# EAGLE design MotorShieldV0.99.3-3 (EAGLE 9.5.0)
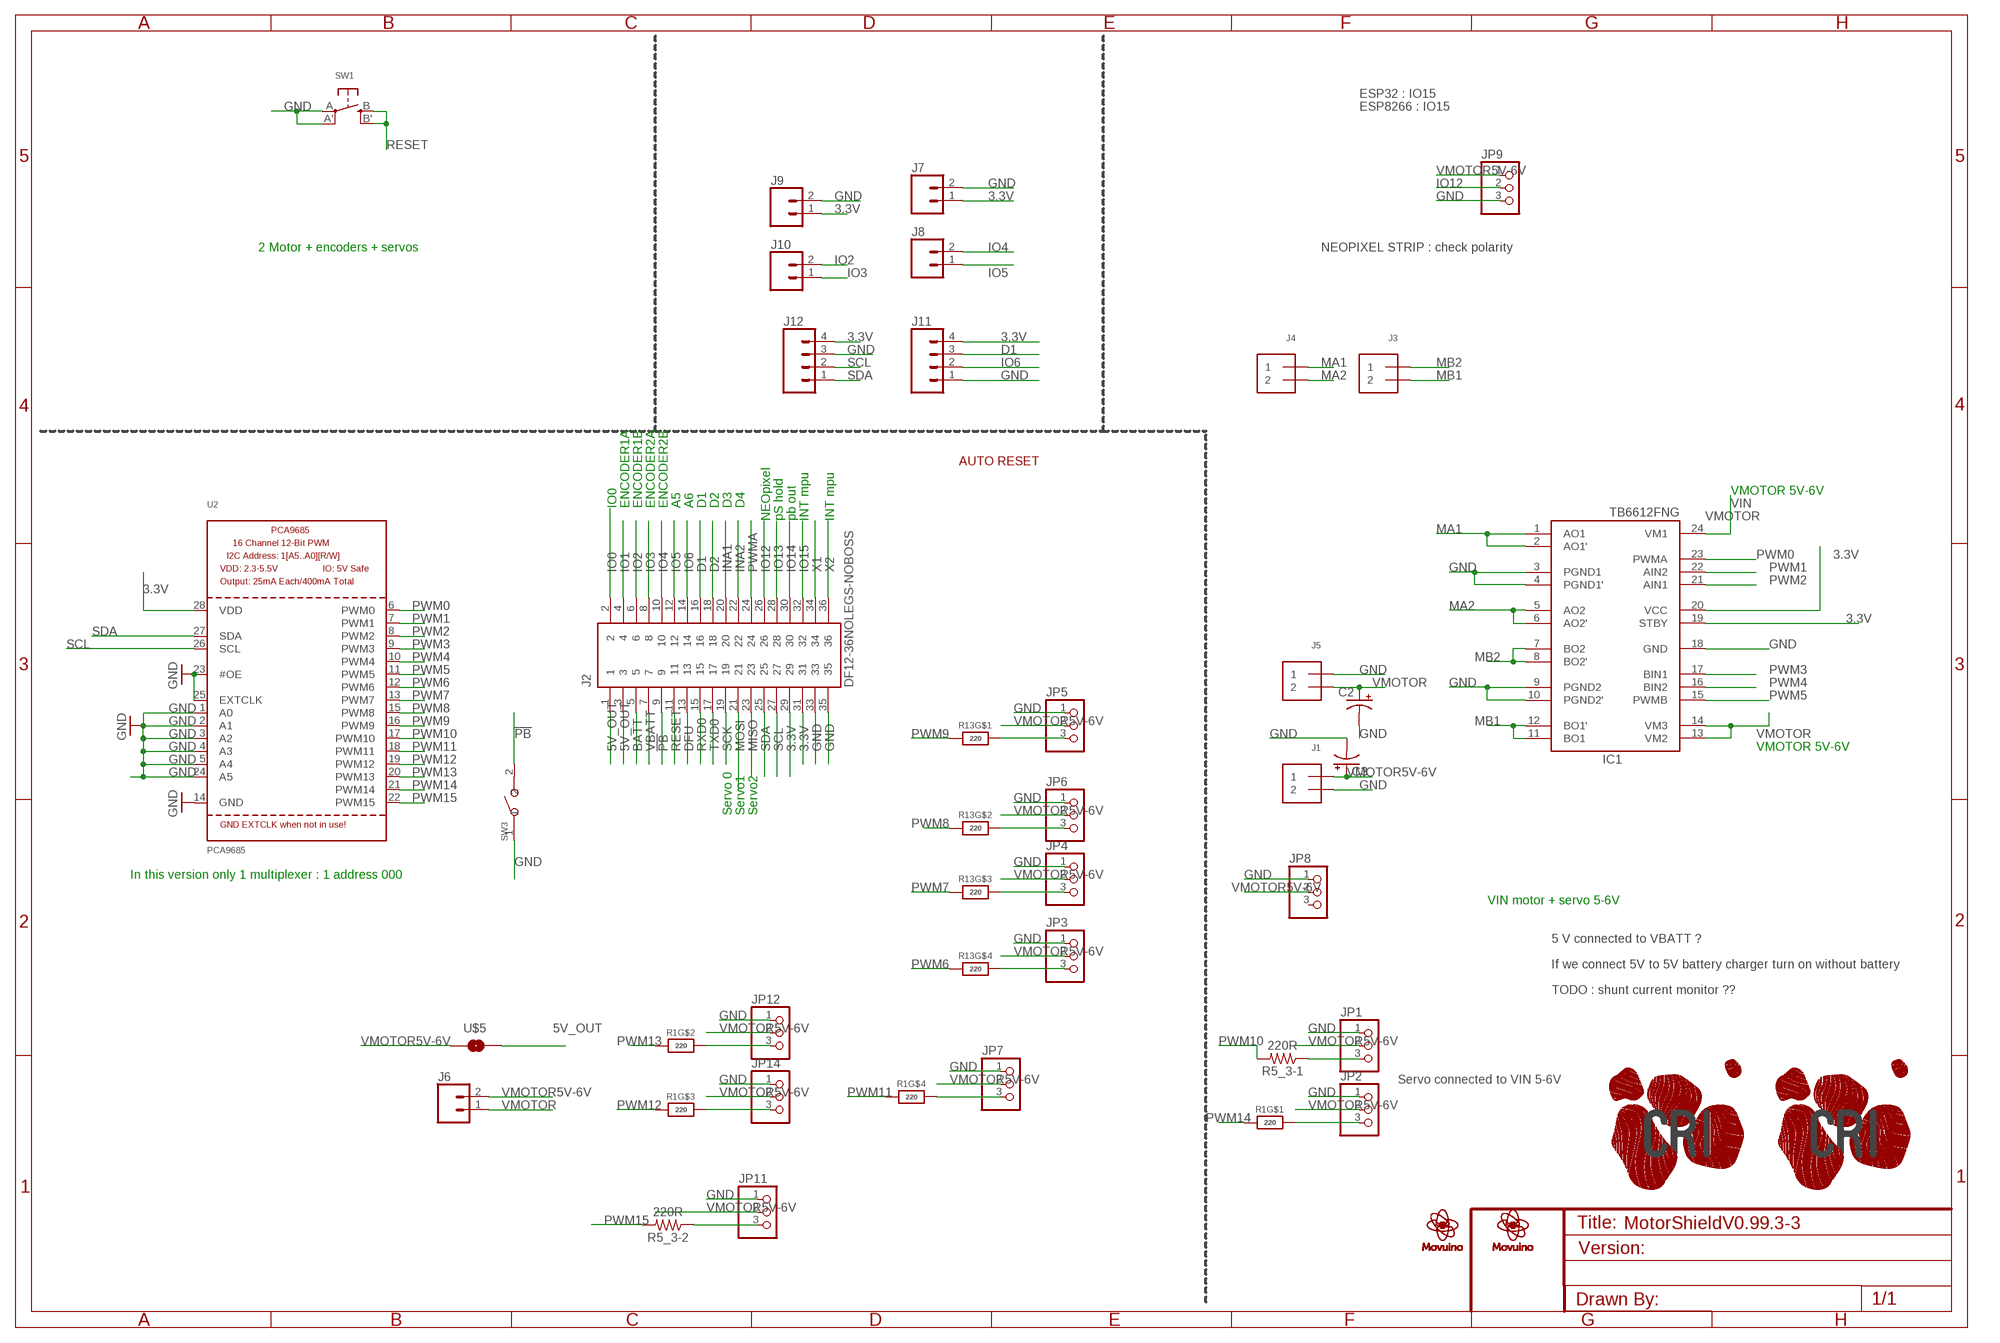
[diagram p0: schematic, sheet 1]

## Parts
C2  CPOL-USE3.5-8  [E3,5-8]
C3  CPOL-USE3.5-8  [E3,5-8]
IC1  TB6612FNG  [SSOP24]
J1  TERMBLOCK_1X2  [TERMBLOCK_1X2-3.5MM]
J2  DF12-36NOLEGS-NOBOSS  [DF12-36-DP-NL-NB]
J3  TERMBLOCK_1X2  [TERMBLOCK_1X2-3.5MM]
J4  TERMBLOCK_1X2  [TERMBLOCK_1X2-3.5MM]
J5  TERMBLOCK_1X2  [TERMBLOCK_1X2-3.5MM]
J6  CONN_02  [1X02]
J7  CONN_02  [1X02]
J8  CONN_02  [1X02]
J9  CONN_02  [1X02]
J10  CONN_02  [1X02]
J11  CONN_04  [1X04]
J12  CONN_04  [1X04]
JP1  PINHD-1X3  [1X03]
JP2  PINHD-1X3  [1X03]
JP3  PINHD-1X3  [1X03]
JP4  PINHD-1X3  [1X03]
JP5  PINHD-1X3  [1X03]
JP6  PINHD-1X3  [1X03]
JP7  PINHD-1X3  [1X03]
JP8  PINHD-1X3  [1X03]
JP9  PINHD-1X3  [1X03]
JP11  PINHD-1X3  [1X03]
JP12  PINHD-1X3  [1X03]
JP14  PINHD-1X3  [1X03]
R1  220  RESISTOR_4PACK  [RESPACK_4X0603]
R5_3-1  220R  RESISTORR0402-SMALL-TDOCU  [R0402-SMALL-TDOCU]
R5_3-2  220R  RESISTORR0402-SMALL-TDOCU  [R0402-SMALL-TDOCU]
R13  220  RESISTOR_4PACK  [RESPACK_4X0603]
SW1  SWITCH_TACT_SMT  [EVQ-Q2]
SW3  DIP-BUTTON(2P-6.0X3.0X4.3MM)-TS-1101F  [SW2-5.0-6.0X3.0X4.3MM]
U2  PCA9685  [TSSOP28]
U$1  LOGO_MOVUINOTOP  [LOGO_MOVUINO_BMP_10MM]
U$2  LOGO-CRI-NEW-110MM-BOTTOM-SILK  [LOGO_CRI-NEW-BMP10MM-BOTTOM]
U$3  LOGO-CRI-NEW-110MM-BOTTOM-SILK  [LOGO_CRI-NEW-BMP10MM-BOTTOM]
U$5  0402-JUMPERCLOSED-DEFAULT  [0402-JUMPER-CLOSED]
U$8  LOGO_MOVUINOBOTTOM_11MM  [LOGO_MOVUINO_BMP_11MM-BOTTOM]

## Nets
3.3V [pcbway_cheap]: IC1.19(STBY) IC1.20(VCC) J2.29 J2.31 J7.1 J9.1 J11.4 J12.4 U2.28(VDD)
5V_OUT [pcbway_cheap]: J2.1 J2.3 U$5.2
!PB! [pcbway_cheap]: J2.9 SW3.2
BATT [pcbway_cheap]: J2.5
D1 [pcbway_cheap]: J2.16 J11.3
D2 [pcbway_cheap]: J2.18
DFU [pcbway_cheap]: J2.13
GND [pcbway_cheap]: C2.- C3.- IC1.3(PGND1) IC1.4(PGND1') IC1.9(PGND2) IC1.10(PGND2') IC1.18(GND) J1.2 J2.33 J2.35 J5.1 J7.2 J9.2 J11.1 J12.3 JP1.1 JP2.1 JP3.1 JP4.1 JP5.1 JP6.1 JP7.1 JP8.1 JP9.3 JP11.1 JP12.1 JP14.1 SW1.A'(P1) SW1.A(P) SW3.1 U2.1(A0) U2.2(A1) U2.3(A2) U2.4(A3) U2.5(A4) U2.14(GND) U2.23(#OE) U2.24(A5) U2.25(EXTCLK)
INA1 [pcbway_cheap]: J2.20
INA2 [pcbway_cheap]: J2.22
IO0 [pcbway_cheap]: J2.2
IO1 [pcbway_cheap]: J2.4
IO2 [pcbway_cheap]: J2.6 J10.2
IO3 [pcbway_cheap]: J2.8 J10.1
IO4 [pcbway_cheap]: J2.10 J8.2
IO5 [pcbway_cheap]: J2.12 J8.1
IO6: J2.14 J11.2
IO12 [pcbway_cheap]: J2.26 JP9.2
IO13 [pcbway_cheap]: J2.28
IO14 [pcbway_cheap]: J2.30
IO15 [pcbway_cheap]: J2.32
MA1 [pcbway_cheap]: IC1.1(AO1) IC1.2(AO1') J4.1
MA2 [pcbway_cheap]: IC1.5(AO2) IC1.6(AO2') J4.2
MB1 [pcbway_cheap]: IC1.11(BO1) IC1.12(BO1') J3.2
MB2 [pcbway_cheap]: IC1.7(BO2) IC1.8(BO2') J3.1
MISO [pcbway_cheap]: J2.23
MOSI [pcbway_cheap]: J2.21
N$2: JP5.3 R13.8
N$3: JP6.3 R13.7
N$4: JP4.3 R13.6
N$6: JP3.3 R13.5
N$7: JP1.3 R5_3-1.1
N$8: JP2.3 R1.8
N$10: JP12.3 R1.7
N$11: JP14.3 R1.6
N$17: JP7.3 R1.5
N$18: JP11.3 R5_3-2.1
PWM0 [pcbway_cheap]: IC1.23(PWMA) U2.6(PWM0)
PWM1 [pcbway_cheap]: IC1.22(AIN2) U2.7(PWM1)
PWM2 [pcbway_cheap]: IC1.21(AIN1) U2.8(PWM2)
PWM3 [pcbway_cheap]: IC1.17(BIN1) U2.9(PWM3)
PWM4 [pcbway_cheap]: IC1.16(BIN2) U2.10(PWM4)
PWM5 [pcbway_cheap]: IC1.15(PWMB) U2.11(PWM5)
PWM6 [pcbway_cheap]: R13.4 U2.12(PWM6)
PWM7 [pcbway_cheap]: R13.3 U2.13(PWM7)
PWM8 [pcbway_cheap]: R13.2 U2.15(PWM8)
PWM9 [pcbway_cheap]: R13.1 U2.16(PWM9)
PWM10 [pcbway_cheap]: R5_3-1.2 U2.17(PWM10)
PWM11 [pcbway_cheap]: R1.4 U2.18(PWM11)
PWM12 [pcbway_cheap]: R1.3 U2.19(PWM12)
PWM13 [pcbway_cheap]: R1.2 U2.20(PWM13)
PWM14 [pcbway_cheap]: R1.1 U2.21(PWM14)
PWM15 [pcbway_cheap]: R5_3-2.2 U2.22(PWM15)
PWMA [pcbway_cheap]: J2.24
RESET [pcbway_cheap]: J2.11 SW1.B'(S1) SW1.B(S)
RXD0 [pcbway_cheap]: J2.15
SCK [pcbway_cheap]: J2.19
SCL [pcbway_cheap]: J2.27 J12.2 U2.26(SCL)
SDA [pcbway_cheap]: J2.25 J12.1 U2.27(SDA)
TXD0 [pcbway_cheap]: J2.17
VBATT [pcbway_cheap]: J2.7
VMOTOR: C2.+ IC1.13(VM2) IC1.14(VM3) IC1.24(VM1) J5.2 J6.1
VMOTOR5V-6V [pcbway_cheap]: C3.+ J1.1 J6.2 JP1.2 JP2.2 JP3.2 JP4.2 JP5.2 JP6.2 JP7.2 JP8.2 JP9.1 JP11.2 JP12.2 JP14.2 U$5.1
X1 [pcbway_cheap]: J2.34
X2 [pcbway_cheap]: J2.36
Unconnected: JP8.3

## Notes on the sheet
- ESP32 : IO15
- ESP8266 : IO15
- 2 Motor + encoders + servos | NEOPIXEL STRIP : check polarity
- AUTO RESET
- VMOTOR 5V-6V
- IO0 | ENCODER1A | ENCODER1B | ENCODER2A | ENCODER2B | A5 | A6 | D1 | D2 | D3 | D4 | VIN
- NEOpixel | pS hold | pb out | INT mpu | INT mpu
- VMOTOR 5V-6V
- Servo 0 | Servo1 | Servo2
- In this version only 1 multiplexer : 1 address 000
- VIN motor + servo 5-6V
- 5 V connected to VBATT ?
- If we connect 5V to 5V battery charger turn on without battery
- TODO : shunt current monitor ??
- Servo connected to VIN 5-6V

## Library data of the parts
C2 C3 = adafruit:CPOL-US: POLARIZED CAPACITOR, American symbol
IC1 = adafruit:TB6612FNG: TB6612FNG MOS dual H-bridge motor driver, 1.2A current 3.2A peak 3 or 5v logic and 3-15v motor
J1 J3-J5 = microbuilder:TERMBLOCK_1X2: 3.5mm Terminal block http://www.ladyada.net/library/pcb/eaglelibrary.html
J2 = movuino:DF12-36: CONN HEADER 32POS 3MM SMD 0.5MM
J6-J10 = SparkFun-Connectors:CONN_02: Multi connection point. Often used as Generic Header-pin footprint for 0.1 inch spaced/style header connections On any of the 0.1 inch spaced packages, you can populate with these: Break Away Headers - Straight <https://www.sparkfun.com/products/116> (PRT-00116) Break Away Male Headers - Right Angle <https://www.sparkfun.com/products/553> (PRT-00553) Female Headers <https://www.sparkfun.com/products/115> (PRT-00115) Break Away Headers - Machine Pin <https://www.sparkfun.com/products/117> (PRT-00117) Break Away Female Headers - Swiss Machine Pin <https://www.sparkfun.com/products/743> (PRT-00743) For SCREWTERMINALS and SPRING TERMINALS visit here: Screw Terimnals on SparkFun.com <https://www.sparkfun.com/search/results?term=Screw+Terminals> (5mm/3.5mm/2.54mm spacing) This device is also useful as a general connection point to wire up your design to another part of your project. Our various solder wires solder well into these plated through hole pads. Hook-Up Wire - Assortment (Stranded, 22 AWG) <https://www.sparkfun.com/products/11375> (PRT-11375) Hook-Up Wire - Assortment (Solid Core, 22 AWG) <https://www.sparkfun.com/products/11367> (PRT-11367) View the entire wire category on our website here <https://www.sparkfun.com/categories/141> Special notes: Molex polarized connector foot print use with: PRT-08233 with associated crimp pins and housings. 2.54_SCREWTERM for use with PRT-10571. 3.5mm Screw Terminal footprints for PRT-08084 5mm Screw Terminal footprints for use with PRT-08432
J11 J12 = SparkFun-Connectors:CONN_04: Multi connection point. Often used as Generic Header-pin footprint for 0.1 inch spaced/style header connections On any of the 0.1 inch spaced packages, you can populate with these: Break Away Headers - Straight <https://www.sparkfun.com/products/116> (PRT-00116) Break Away Male Headers - Right Angle <https://www.sparkfun.com/products/553> (PRT-00553) Female Headers <https://www.sparkfun.com/products/115> (PRT-00115) Break Away Headers - Machine Pin <https://www.sparkfun.com/products/117> (PRT-00117) Break Away Female Headers - Swiss Machine Pin <https://www.sparkfun.com/products/743> (PRT-00743) For SCREWTERMINALS and SPRING TERMINALS visit here: Screw Terimnals on SparkFun.com <https://www.sparkfun.com/search/results?term=Screw+Terminals> (5mm/3.5mm/2.54mm spacing) This device is also useful as a general connection point to wire up your design to another part of your project. Our various solder wires solder well into these plated through hole pads. Hook-Up Wire - Assortment (Stranded, 22 AWG) <https://www.sparkfun.com/products/11375> (PRT-11375) Hook-Up Wire - Assortment (Solid Core, 22 AWG) <https://www.sparkfun.com/products/11367> (PRT-11367) View the entire wire category on our website here <https://www.sparkfun.com/categories/141> Special notes: Molex polarized connector foot print use with SKU : PRT-08231 with associated crimp pins and housings. 1MM SMD Version SKU: PRT-10208; PROD_ID: CONN-09696
JP1-JP9 JP11 JP12 JP14 = adafruit:PINHD-1X3: PIN HEADER
R1 R13 = microbuilder:RESISTOR_4PACK: Resistor Packs (4 resistors) 4 x 0603 10K 1/16W - Digikey: YC164J-10KCT-ND
R5_3-1 R5_3-2 = movuinoV0:RESISTOR: Resistor Basic schematic elements and footprints for 0402 , 0603, 1206, and PTH resistors.
SW1 = movuino:SWITCH_TACT_SMT: SMT Tact Switches 6x6mm - Digikey: P12940SCT-ND KMR2 (4.6x2.8mm) - Digikey: 401-1426-1-ND EVQ-PQHB55 - Light Touch, 160GF (4.5x4.5mm) - Digikey: P8090SCT-ND KMT0 - KMT021 NGJ LHS (etc.) IP68/Waterproof - Digikey: CKN10289CT-ND
SW3 = movuino:DIP-BUTTON(2P-6.0X3.0X4.3MM): DIP Button Front -white; Open Part List Seeed; MF: Baisite; MPN: TS-1101F; OC_SEEED: 311020025
U2 = microbuilder:PCA9685: PCA9685 - 16 Channel 12-Bit I2C PWM Controller 5.0V tolerant 16 channel, 12-bit I2C PWM controller with 25mA per output (max. 400mA total) Digikey: 568-5931-1-ND
U$1 U$8 = movuino:LOGO_MOVUINO
U$2 U$3 = movuino:LOGO-CRI-NEW-1
U$5 = movuino:0402-JUMPER

## Net classes
1 pcbway_smallest: width 0.102 mm, drill 0.2 mm, clearance 0.102 mm
2 pcbway_cheap: width 0.152 mm, drill 0.3 mm, clearance 0.152 mm

## Board
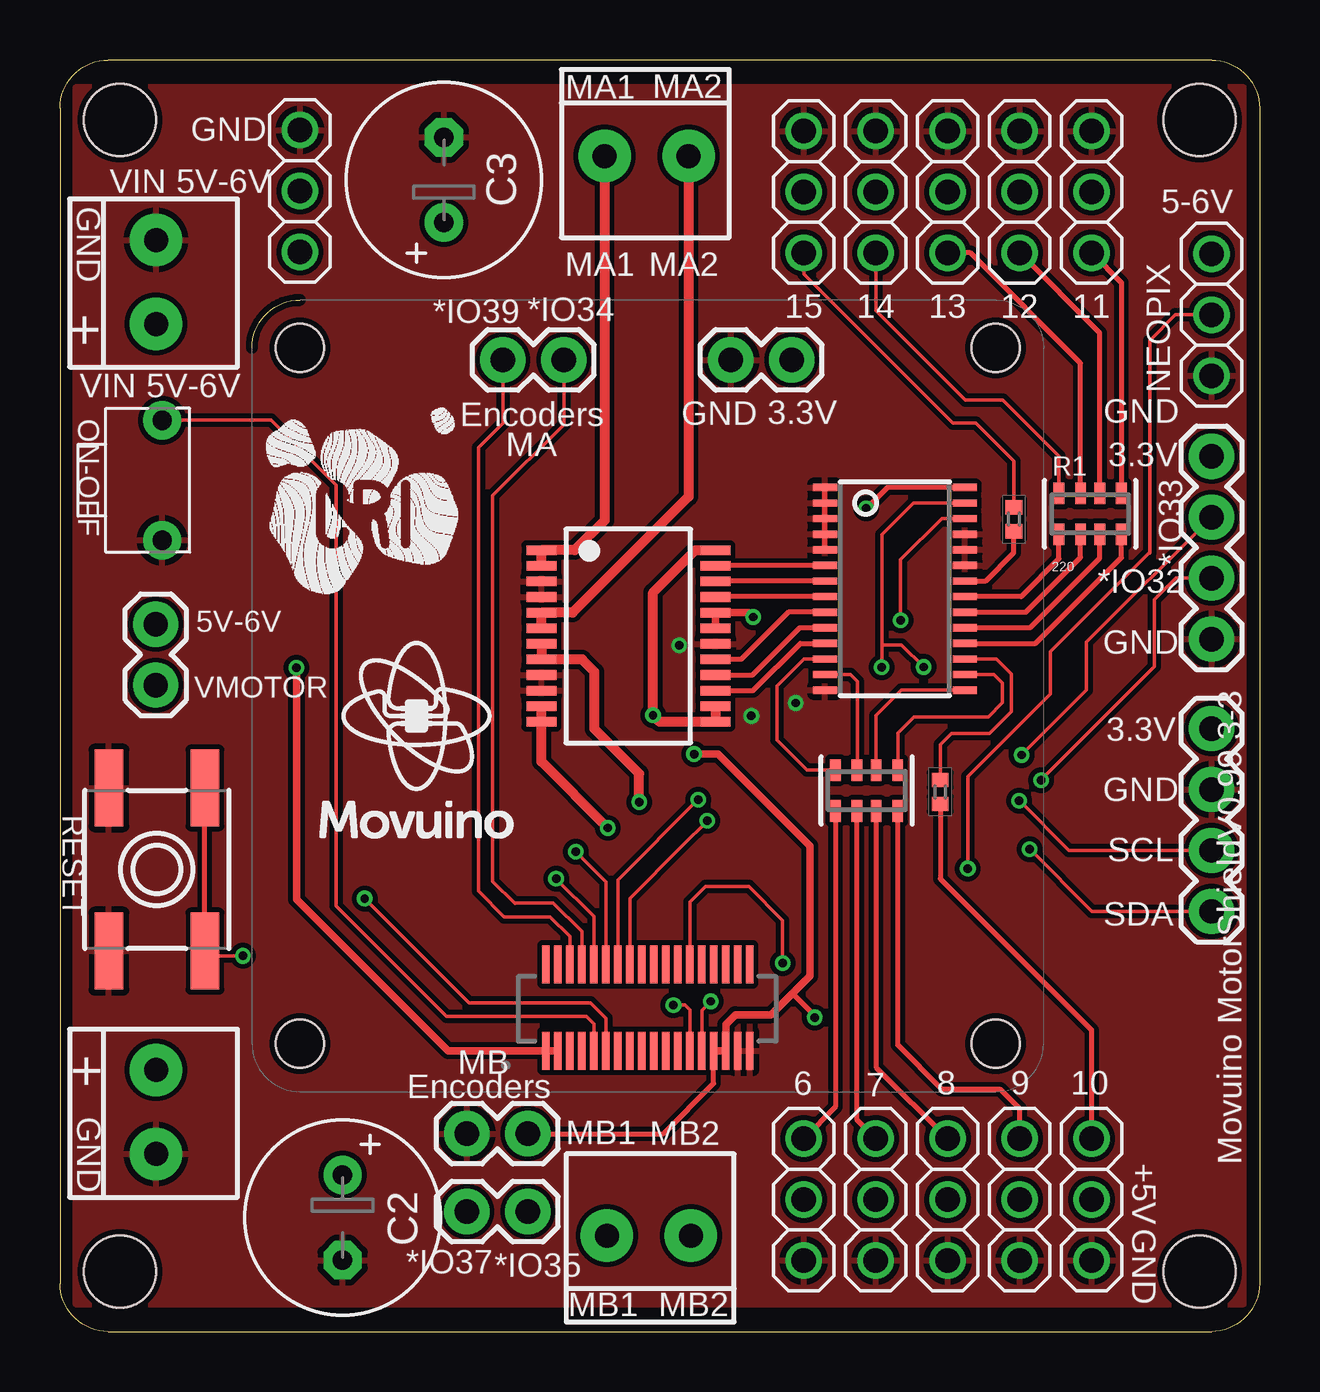
[diagram p1: board, top side]
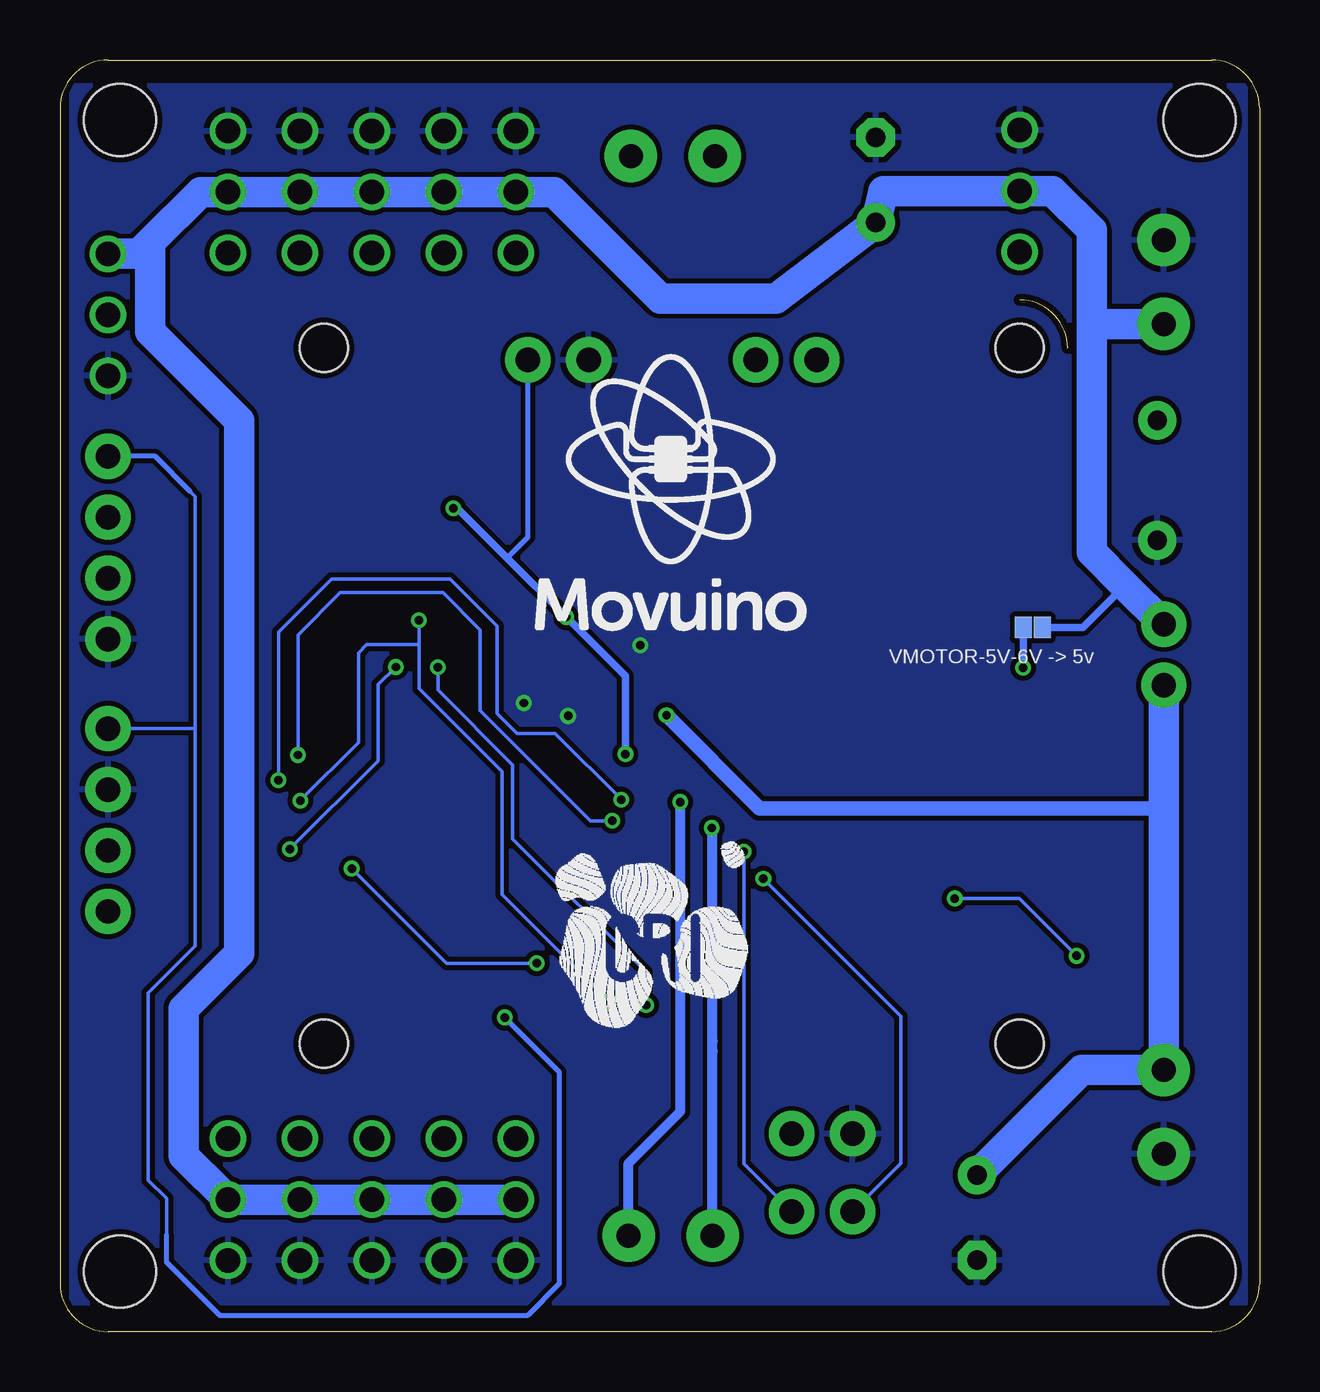
[diagram p2: board, bottom side, seen from below]

Size 50 x 53 mm. Coordinates in mm from the lower left corner, seen from the top.
Outline: 8,41 arc-90 10,43
Outline: 0,51 0,2 arc90 2,0 48,0 arc90 50,2 50,51 arc90 48,53 2,53 arc90 0,51
Copper layers (1*16): Top 0.035mm / dielectric 1.5mm / Bottom 0.035mm
Design rules "PCBWAY_2layer_DRU_no_angle_cheap *": minimum track width 6mil, minimum drill 0.3mm, track to track 6mil, track to pad 6mil, pad to pad 6mil, via to via 6mil, smd to smd 0mil, copper to edge 10mil, drill to drill 10mil, minimum pad ring 10mil, minimum via ring 6mil, stop-mask expansion 2mil, vias tented up to drill 100mil, thermal gap 10mil
Holes 2 mm at 39,41 10,12 10,41 39,12
Holes 3 mm at 2.5,50.5 2.5,2.5 47.5,50.5 47.5,2.5

### Footprints (pad centres in the part's own frame; a part is rotated, then mirrored left to right if it is on the bottom)
E3,5-8 = drill 0.813 pad 1.6: + -1.778,0 | drill 0.813 pad 1.6 octagon: - 1.778,0
SSOP24 = smd 0.4 x 1.25: 1 -3.575,-3.625; 2 -2.925,-3.625; 3 -2.275,-3.625; 4 -1.625,-3.625; 5 -0.975,-3.625; 6 -0.325,-3.625; 7 0.325,-3.625; 8 0.975,-3.625; 9 1.625,-3.625; 10 2.275,-3.625; 11 2.925,-3.625; 12 3.575,-3.625; 13 3.575,3.625; 14 2.925,3.625; 15 2.275,3.625; 16 1.625,3.625; 17 0.975,3.625; 18 0.325,3.625; 19 -0.325,3.625; 20 -0.975,3.625; 21 -1.625,3.625; 22 -2.275,3.625; 23 -2.925,3.625; 24 -3.575,3.625
TERMBLOCK_1X2-3.5MM = drill 1 pad 2.184: 1 1.8,0; 2 -1.7,0
DF12-36-DP-NL-NB = smd 0.3 x 1.6: 1 -4.25,-1.8; 2 -4.25,1.8; 3 -3.75,-1.8; 4 -3.75,1.8; 5 -3.25,-1.8; 6 -3.25,1.8; 7 -2.75,-1.8; 8 -2.75,1.8; 9 -2.25,-1.8; 10 -2.25,1.8; 11 -1.75,-1.8; 12 -1.75,1.8; 13 -1.25,-1.8; 14 -1.25,1.8; 15 -0.75,-1.8; 16 -0.75,1.8; 17 -0.25,-1.8; 18 -0.25,1.8; 19 0.25,-1.8; 20 0.25,1.8; 21 0.75,-1.8; 22 0.75,1.8; 23 1.25,-1.8; 24 1.25,1.8; 25 1.75,-1.8; 26 1.75,1.8; 27 2.25,-1.8; 28 2.25,1.8; 29 2.75,-1.8; 30 2.75,1.8; 31 3.25,-1.8; 32 3.25,1.8; 33 3.75,-1.8; 34 3.75,1.8; 35 4.25,-1.8; 36 4.25,1.8
1X02 = drill 1.016 pad 1.88: 1 0,0; 2 2.54,0
1X04 = drill 1.016 pad 1.88: 1 0,0; 2 2.54,0; 3 5.08,0; 4 7.62,0
1X03 = drill 1.016: 1 -2.54,0; 2 0,0; 3 2.54,0
RESPACK_4X0603 = smd 0.45 x 0.9: 1 -1.3,-0.85; 2 -0.4,-0.85; 3 0.4,-0.85; 4 1.3,-0.85; 5 1.3,0.85; 6 0.4,0.85; 7 -0.4,0.85; 8 -1.3,0.85
R0402-SMALL-TDOCU = smd 0.6 x 0.7: 1 -0.5,0; 2 0.5,0
EVQ-Q2 = smd 3.2 x 1.2: A -3.4,-2; A' 3.4,-2; B -3.4,2; B' 3.4,2
SW2-5.0-6.0X3.0X4.3MM = drill 0.8 pad 1.6: 1 -2.5,0; 2 2.5,0
TSSOP28 = smd 0.305 x 0.991: 1 -4.225,-2.918; 2 -3.575,-2.918; 3 -2.925,-2.918; 4 -2.275,-2.918; 5 -1.625,-2.918; 6 -0.975,-2.918; 7 -0.325,-2.918; 8 0.325,-2.918; 9 0.975,-2.918; 10 1.625,-2.918; 11 2.275,-2.918; 12 2.925,-2.918; 13 3.575,-2.918; 14 4.225,-2.918; 15 4.225,2.918; 16 3.575,2.918; 17 2.925,2.918; 18 2.275,2.918; 19 1.625,2.918; 20 0.975,2.918; 21 0.325,2.918; 22 -0.325,2.918; 23 -0.975,2.918; 24 -1.625,2.918; 25 -2.275,2.918; 26 -2.925,2.918; 27 -3.575,2.918; 28 -4.225,2.918
0402-JUMPER-CLOSED = smd 0.7 x 0.9: 1 -0.4,0; 2 0.4,0

### Placement (x,y rotation side)
C2  11.78,4.75 270 top
C3  16,48 90 top
IC1  23.69,28.99 270 top
J1  4,43.8 270 top
J2  24.5,13.5 0 top
J3  24.5,4 0 top
J4  24.5,49 180 top
J5  4,9.2 270 top
J6  3.99,26.94 90 top
J7  19.5,8.25 180 top
J8  19.5,5 180 top
J9  30.5,40.5 180 top
J10  21,40.5 180 top
J11  48,28.86 90 top
J12  48,17.51 90 top
JP1  43,5.5 90 top
JP2  34,47.5 270 top
JP3  31,5.5 90 top
JP4  34,5.5 90 top
JP5  40,5.5 90 top
JP6  37,5.5 90 top
JP7  43,47.5 270 top
JP8  10,47.54 270 top
JP9  48,42.38 270 top
JP11  31,47.5 270 top
JP12  37,47.5 270 top
JP14  40,47.5 270 top
R1  42.94,34.08 0 top
R5_3-1  36.69,22.49 90 top
R5_3-2  39.76,33.86 270 top
R13  33.62,22.55 180 top
SW1  4.04,19.26 270 top
SW3  4.26,35.48 90 top
U2  34.8,30.96 270 top
U$1  14.79,25.66 0 top
U$2  12.77,34.27 0 bottom
U$3  25.15,16.19 0 top
U$5  9.45,29.35 180 bottom
U$8  24.5,36.34 0 top

### Tracks (layer width: path | path; a pad name or v marks a point on that pad's centre or on a via)
3.3V  (via drill 0.35)
  Top 0.2: U2.28 34.48,35.19 v33.61,34.31 | J7.1 25.15,8.25 27.24,10.34 J2.29 | 30.52,14.09 31.46,13.15 v31.46,13.09
  Top 0.305: J2.29 J2.31 27.75,12.8 28.15,13.2 29.64,13.2 30.52,14.09 31.26,14.82 31.26,20.24 27.43,24.07 v26.43,24.07 | IC1.20 27.4,29.96 | 27.4,29.96 28.7,29.96 v28.89,29.78 | IC1.19 27.32,29.88 27.4,29.96
  Bottom 0.152: 45.56,4.02 45.56,5.55 46.32,6.31 46.32,14.12 44.37,16.07 44.37,25.14 | 44.37,25.14 44.37,34.81 44.58,35.02 | J12.4 44.38,25.13 44.37,25.14
  Bottom 0.2: 31.36,32.25 30.5,33.11 J9.1 | J11.4 46.04,36.48 44.58,35.02 | v31.46,13.09 29.19,10.82 29.19,1.99 30.52,0.66 43.33,0.66 45.56,2.89 45.56,4.02
  Bottom 0.305: v33.61,34.31 33.42,34.31 31.36,32.25 v28.89,29.78 26.43,27.32 v26.43,24.07
5V_OUT  (via drill 0.35)
  Top 0.305: J2.3 J2.1 16.18,11.7 9.86,18.02 v9.86,27.67
  Bottom 0.305: v9.86,27.67 v9.85,27.68 U$5.2
!PB!
  Top 0.152: J2.9 22.25,12.83 21.95,13.13 16.12,13.13 11.5,17.75 11.5,35.29 8.81,37.98 SW3.2
D1  (via drill 0.35)
  Top 0.152: J11.3 42.79,28.73 42.79,26.74 v40.08,24.03 | v26.98,21.29 25.93,20.24 23.75,18.06 J2.16
  Bottom 0.152: v40.08,24.03 40.08,29.04 38.32,30.8 34.04,30.8 32.49,29.25 32.49,25.89 27.89,21.29 v26.98,21.29
GND  (via drill 0.35)
  Top 0.2: U2.5 U2.4 U2.3 U2.2 U2.1
  other vias: 25.81,28.61 28.82,25.66 30.67,26.2
  pour Top (isolate 0.203): 49.35,51.86 0.64,51.86 0.64,1.14 49.35,1.14
  pour Bottom (isolate 0.203): 49.48,51.93 0.61,51.93 0.61,1.19 49.48,1.19
IO2
  Top 0.152: J10.2 18.46,37.86 17.44,36.84 17.44,22.75 17.44,22.58 17.44,18.36 18.52,17.28 20.43,17.28 21.25,16.46 J2.6
IO3
  Top 0.152: J10.1 21,37.81 18.04,34.85 18.04,18.76 18.96,17.84 18.98,17.86 20.56,17.86 21.75,16.67 J2.8
IO4  (via drill 0.35)
  Top 0.152: J2.10 22.25,17.3 v20.68,18.87
  Bottom 0.152: v20.68,18.87 14.94,13.13 14.94,7.02 J8.2
IO5  (via drill 0.35)
  Top 0.152: J2.12 22.75,18.75 v21.5,20
  Bottom 0.152: v21.5,20 21.5,7 J8.1
IO6  (via drill 0.35)
  Top 0.152: J2.14 23.25,18.82 v26.6,22.17 | v40.89,22.98 45.62,27.71 45.62,30.51 46.51,31.4 J11.2
  Bottom 0.152: v26.6,22.17 29.36,24.93 30.95,24.93 31.79,25.77 31.79,29.41 33.75,31.37 38.68,31.37 40.89,29.16 v40.89,22.98
IO12  (via drill 0.35)
  Top 0.152: v30.12,15.35 30.12,17.14 28.71,18.55 26.9,18.55 26.25,17.9 J2.26 | v37.84,19.3 37.84,23.13 41.28,26.57 41.28,28.34 45.38,32.44 45.42,32.44 45.42,41.31 46.49,42.38 JP9.2
  Bottom 0.152: v30.12,15.35 33.89,15.35 v37.84,19.3
MA1
  Top 0.406: IC1.2 IC1.1 21.45,32.56 22.7,33.81 J4.1
MA2
  Top 0.406: IC1.6 IC1.5 21.37,29.96 26.2,34.8 J4.2
MB1  (via drill 0.35)
  Top 0.406: v22.83,20.99 20.06,23.76 IC1.12 IC1.11
  Bottom 0.406: J3.2 22.8,11.69 22.8,12.1 22.8,15.61 22.8,20.96 v22.83,20.99
MB2  (via drill 0.35)
  Top 0.406: v24.14,22.07 24.14,23.26 22.28,25.12 22.28,27.5 21.77,28.02 IC1.8 IC1.7
  Bottom 0.406: J3.1 26.3,7.02 24.14,9.18 v24.14,22.07
N$2
  Top 0.203: JP5.3 40,9.29 39.2,10.09 36.77,10.09 34.92,11.94 R13.8
N$3
  Top 0.203: R13.7 34.02,11.02 JP6.3
N$4
  Top 0.2: 33.22,8.82 R13.6
  Top 0.203: JP4.3 33.22,8.82
N$6
  Top 0.203: R13.5 32.32,9.36 JP3.3
N$7
  Top 0.203: R5_3-1.1 36.69,18.87 43,12.56 JP1.3
N$8
  Top 0.152: JP2.3 34,42.56 37.73,38.83 39.31,38.83 41.64,36.5 R1.8
N$10
  Top 0.203: R1.7 42.54,40.36 37.94,44.96 JP12.3
N$11
  Top 0.203: R1.6 43.34,41.62 JP14.3
N$17
  Top 0.203: JP7.3 44.24,43.72 R1.5
N$18
  Top 0.152: JP11.3 31,44.08 37.22,37.86 38.18,37.86 39.76,36.28 R5_3-2.1
PWM0
  Top 0.2: U2.6 27.34,31.93 IC1.23
PWM1
  Top 0.2: U2.7 27.34,31.29 IC1.22
PWM2
  Top 0.2: U2.8 27.34,30.64 IC1.21
PWM3
  Top 0.2: U2.9 30.36,29.98 28.39,28.02 IC1.17
PWM4
  Top 0.2: IC1.16 28.86,27.36 30.84,29.34 U2.10
PWM5
  Top 0.2: IC1.15 28.89,26.71 30.86,28.68 U2.11
PWM6
  Top 0.152: U2.12 31.02,28.04 29.88,26.9 29.88,24.66 31.14,23.4 R13.4
PWM7
  Top 0.152: R13.3 33.24,23.42 33.24,27.1 32.95,27.39 U2.13
PWM8
  Top 0.152: R13.2 34.02,25.68 35.08,26.73 U2.15
PWM9
  Top 0.152: R13.1 34.92,24.94 35.6,25.62 38.69,25.62 39.28,26.21 39.28,27.03 38.92,27.39 U2.16
PWM10
  Top 0.152: U2.17 39.02,28.04 39.65,27.41 39.65,25.85 38.73,24.93 37.15,24.93 36.69,24.47 R5_3-1.2
PWM11
  Top 0.203: R1.4 44.24,32.26 40.66,28.68 U2.18
PWM12
  Top 0.203: R1.3 43.34,32.23 40.45,29.34 U2.19
PWM13
  Top 0.203: U2.20 40.26,29.98 42.54,32.27 R1.2
PWM14
  Top 0.2: 40.06,30.64 U2.21
  Top 0.203: R1.1 41.64,32.21 40.06,30.64
PWM15
  Top 0.203: U2.22 38.59,31.29 39.76,32.46 R5_3-2.2
RESET  (via drill 0.35)
  Top 0.152: J2.11 22.75,13.05 22.11,13.69 17.06,13.69 v12.7,18.05 | v7.62,15.66 6.24,15.66 SW1.B'
  Top 0.2: SW1.B' SW1.B
  Bottom 0.152: v12.7,18.05 10.01,18.05 v7.62,15.66
SCL  (via drill 0.35)
  Top 0.152: v27.12,13.76 26.75,13.39 J2.27 | v35.04,29.65 35.04,32.17 36.75,33.89 U2.26 | J12.2 42.06,20.05 v39.98,22.13
  Bottom 0.152: v35.04,29.65 35.04,28.64 | 35.04,28.64 35.04,26.81 31.58,23.35 31.58,18.22 v27.12,13.76 | v39.98,22.13 37.56,24.55 37.56,28.29 37.21,28.64 35.04,28.64
SDA  (via drill 0.35)
  Top 0.152: J2.25 26.25,13.41 26.05,13.61 v25.57,13.61 | U2.27 35.56,34.53 34.25,33.22 34.25,28.7 | 34.25,28.7 v34.25,27.69 | 34.25,28.7 34.33,28.62 35.08,28.62 v36,27.7 | v40.42,20.11 43.02,17.51 J12.1
  Bottom 0.152: v25.57,13.61 25.57,14.98 31.13,20.54 31.13,23.62 34.25,26.74 v34.25,27.69 | v36,27.7 36.74,26.96 36.74,23.79 v40.42,20.11
VMOTOR  (via drill 0.35)
  Top 0.406: IC1.24 26.48,32.56 24.72,30.8 v24.72,25.69 25,25.41 IC1.13 IC1.14
  Bottom 0.61: 4,21.81 20.84,21.81 v24.72,25.69
  Bottom 1.27: J6.1 4,21.81 J5.2 7.41,10.9 C2.+
VMOTOR5V-6V
  Bottom 0.305: U$5.1 7.36,29.35 5.61,31.1
  Bottom 1.27: 6.99,41.94 6.99,45.9 8.63,47.54 JP8.2 15.68,47.54 C3.+ 20.16,43.06 24.97,43.06 29.41,47.5 JP11.2 JP2.2 JP12.2 JP14.2 JP7.2 44.14,47.5 46.24,45.4 | J1.1 6.93,42 6.99,41.94 | 6.99,41.94 6.99,32.48 5.61,31.1 J6.2 | JP3.2 JP4.2 JP6.2 JP5.2 JP1.2 43.94,6.44 43.96,6.44 44.84,7.33 44.84,13.46 42.54,15.76 42.54,37.97 46.24,41.67 46.24,45.4 | JP9.1 46.72,44.92 46.24,45.4

### Text on the board
tNames: MA1 | MA2 | GND | VIN 5V-6V | 5-6V | GND | MA1 | MA2 | *IO39 | *IO34 | 15 | 14 | 13 | 12 | 11 | + | NEOPIX | VIN 5V-6V | Encoders | GND | 3.3V | GND | MA | 3.3V | ON-OFF | *IO33 | *IO32 | 5V-6V | GND | VMOTOR | 3.3V | GND | SCL | RESET | SDA | + | MB | Encoders | 6 | 7 | 8 | 9 | 10 | MB1 | MB2 | GND | Movuino MotorShieldV0.99.3-3 | +5V | *IO37 | *IO35 | GND | MB1 | MB2
bNames: VMOTOR-5V-6V -> 5v